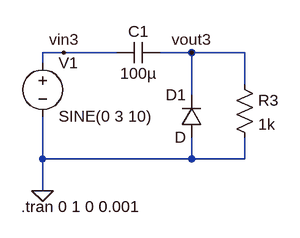
[diagram p0: schematic 1.4.1.asc]
1.4.1.asc, the LTspice schematic file:
Version 4
SHEET 1 880 680
WIRE 48 64 16 64
WIRE 128 64 48 64
WIRE 240 64 192 64
WIRE 320 64 240 64
WIRE 16 80 16 64
WIRE 320 112 320 64
WIRE 240 128 240 64
WIRE 16 224 16 160
WIRE 240 224 240 192
WIRE 240 224 16 224
WIRE 320 224 320 192
WIRE 320 224 240 224
WIRE 16 272 16 224
FLAG 16 272 0
FLAG 48 64 vin3
FLAG 240 64 vout3
SYMBOL voltage 16 64 R0
WINDOW 123 0 0 Left 0
WINDOW 39 0 0 Left 0
SYMATTR InstName V1
SYMATTR Value SINE(0 3 10)
SYMBOL cap 192 48 R90
WINDOW 0 0 32 VBottom 2
WINDOW 3 32 32 VTop 2
SYMATTR InstName C1
SYMATTR Value 100µ
SYMATTR SpiceLine V=4 Irms=0 Rser=0 Lser=0
SYMBOL diode 256 192 R180
WINDOW 0 24 64 Left 2
WINDOW 3 24 0 Left 2
SYMATTR InstName D1
SYMBOL res 304 96 R0
SYMATTR InstName R3
SYMATTR Value 1k
TEXT -16 296 Left 2 !.tran 0 1 0 0.001

The netlist it stands for:
* 1.4.1.asc
V1 vin3 0 SINE(0 3 10)
C1 vout3 vin3 100µ V=4 Irms=0 Rser=0 Lser=0
D1 0 vout3 D
R3 vout3 0 1k
.model D D
.lib standard.dio
.tran 0 1 0 0.001
.backanno
.end

* Results of the author's LTspice run, read from the files saved beside the schematic
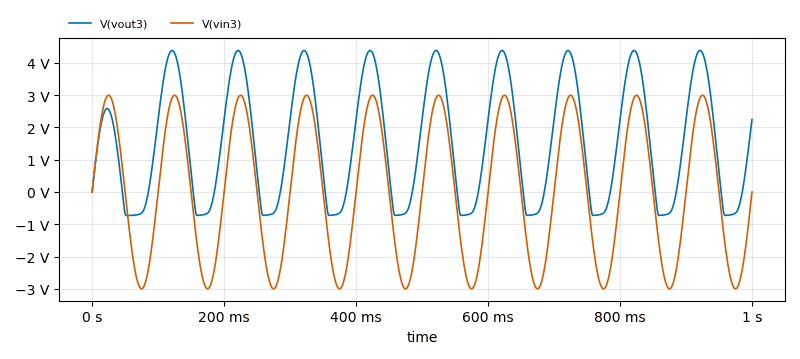
[diagram p1: Transient Analysis of 1.4.1.asc, plotted from the saved traces]
* Transient Analysis, 1 run:
*   V(vout3): min -729.8 mV, max 4.388 V, average 1.52 V, rms 2.402 V, last 2.243 V
*   V(vin3): min -3 V, max 3 V, average -600.5 µV, rms 2.121 V, last 0 V